# EAGLE design hotwave_V6 (EAGLE 8.5.2)
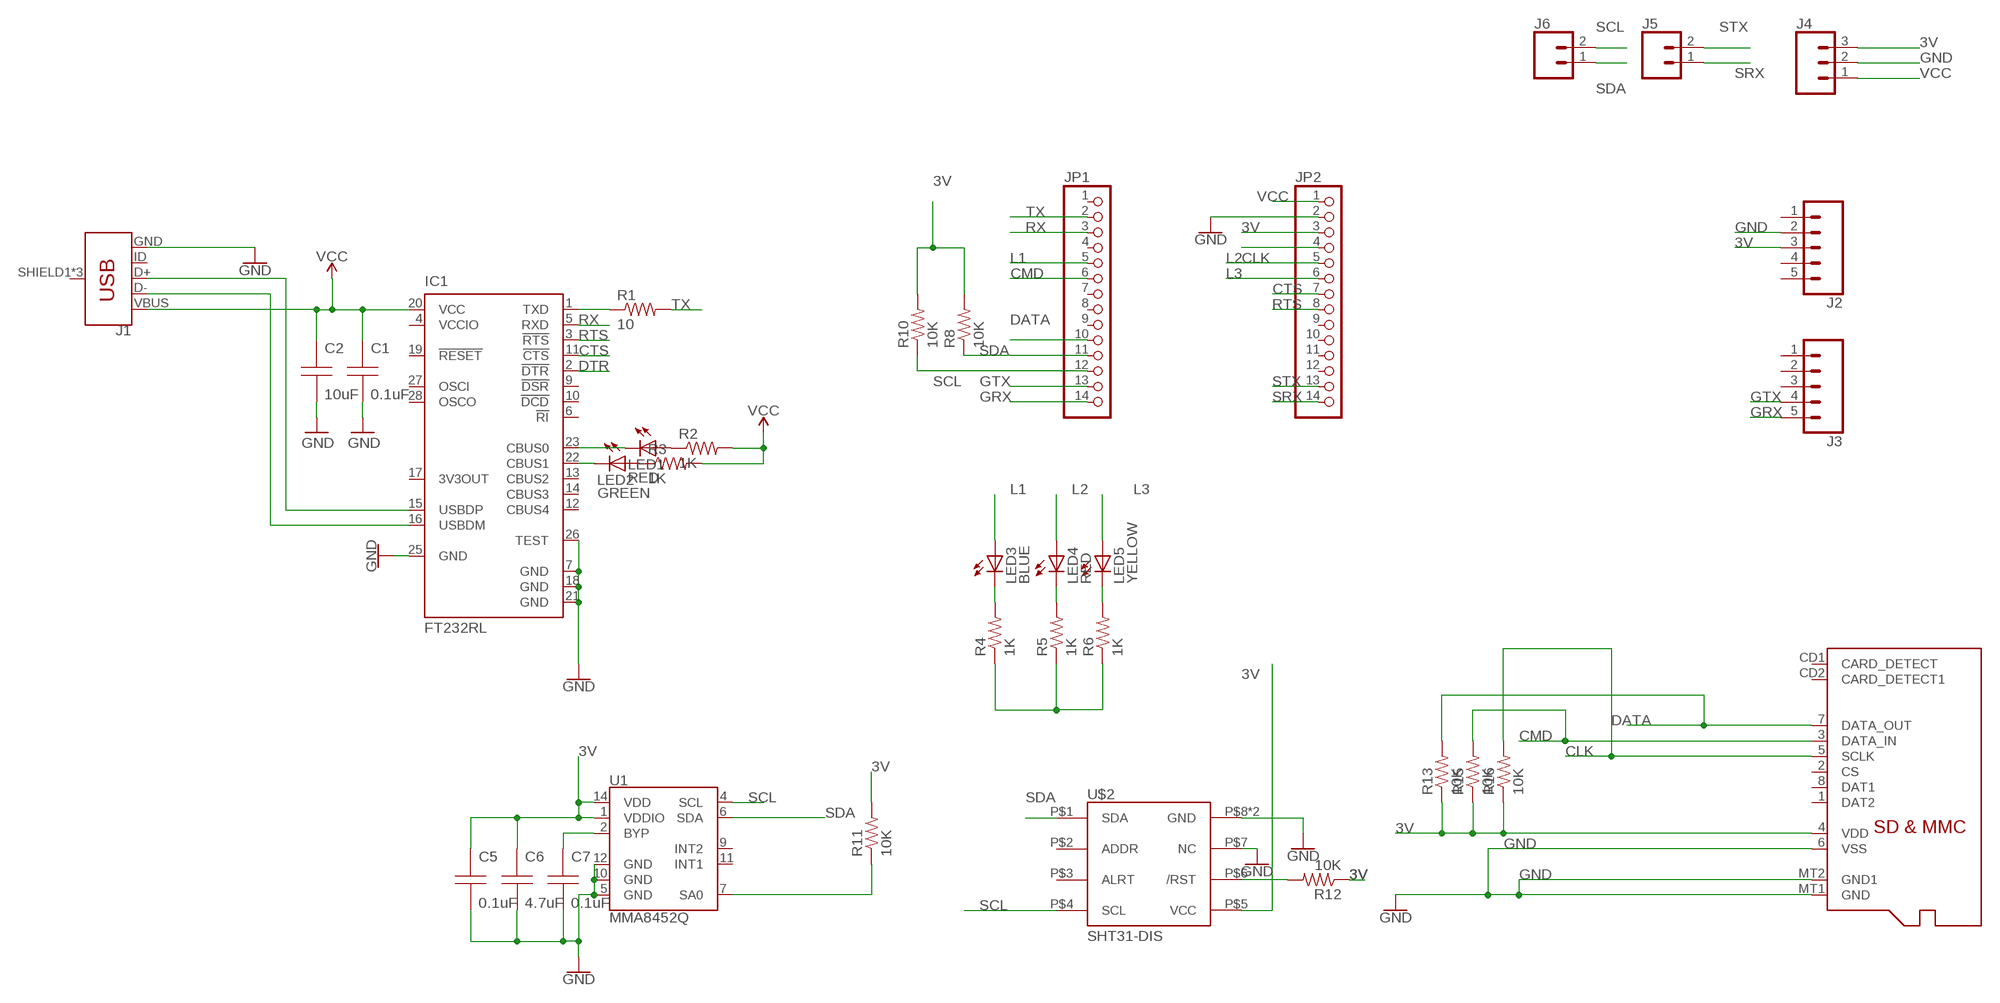
[diagram p0: schematic, sheet 1]

## Parts
C1  0.1uF  CAP  [C0805]
C2  10uF  CAP  [C0805]
C5  0.1uF  CAP  [C0805]
C6  4.7uF  CAP  [C0805]
C7  0.1uF  CAP  [C0805]
IC1  FT232RL  [SSOP28]
J1  USB_MICRO-B_FEMALE-SMT  [USB-B-MICRO-SMD]
J2  CONN_05  [1X05]
J3  CONN_05  [1X05]
J4  CONN_03  [1X03]
J5  CONN_02  [1X02]
J6  CONN_02  [1X02]
JP1  PINHD-1X14-CB  [1X14-CB]
JP2  PINHD-1X14-CB  [1X14-CB]
LED1  RED  LEDSML0805  [SML0805]
LED2  GREEN  LEDSML0805  [SML0805]
LED3  BLUE  LEDSML0805  [SML0805]
LED4  RED  LEDSML0805  [SML0805]
LED5  YELLOW  LEDSML0805  [SML0805]
R1  10  R-US_R0805  [R0805]
R2  1K  R-US_R0805  [R0805]
R3  1K  R-US_R0805  [R0805]
R4  1K  R-US_R0805  [R0805]
R5  1K  R-US_R0805  [R0805]
R6  1K  R-US_R0805  [R0805]
R8  10K  R-US_R0805  [R0805]
R10  10K  R-US_R0805  [R0805]
R11  10K  R-US_R0805  [R0805]
R12  10K  R-US_R0805  [R0805]
R13  10K  R-US_R0805  [R0805]
R15  10K  R-US_R0805  [R0805]
R16  10K  R-US_R0805  [R0805]
U1  MMA8452Q  [QFN-16]
U$1  MICROSD  [MICROSD]
U$2  SHT31-DIS  [SHT3X]

## Nets
3V: C5.1(A) C6.1(A) J2.3 J4.3 JP2.3 R8.2 R10.2 R11.2 R12.1 R13.1 R15.1 R16.1 U1.1(VDDIO) U1.14(VDD) U$1.4(VDD) U$2.P$5(VCC)
CLK: JP2.4 R16.2 U$1.5(SCLK)
CMD: JP1.6 R15.2 U$1.3(DATA_IN)
CTS: IC1.11(!CTS) JP2.7
DATA: JP1.10 R13.2 U$1.7(DATA_OUT)
DTR: IC1.2(!DTR)
GND: C1.2(B) C2.2(B) C5.2(B) C6.2(B) C7.2(B) IC1.7(GND) IC1.18(GND) IC1.21(GND) IC1.25(GND) IC1.26(TEST) J1.GND J2.2 J4.2 JP2.2 R4.1 R5.1 R6.1 U1.5(GND) U1.10(GND) U1.12(GND) U$1.6(VSS) U$1.MT1(GND) U$1.MT2(GND1) U$2.P$7(NC) U$2.P$8(GND) U$2.PAD(GND)
GRX: J3.5 JP1.14
GTX: J3.4 JP1.13
L1: JP1.5 LED3.A
L2: JP2.5 LED4.A
L3: JP2.6 LED5.A
N$1: IC1.15(USBDP) J1.D+
N$2: IC1.16(USBDM) J1.D-
N$3: IC1.1(TXD) R1.1
N$4: LED1.A R2.1
N$5: LED2.A R3.1
N$6: IC1.23(CBUS0) LED1.C
N$7: IC1.22(CBUS1) LED2.C
N$10: R11.1 U1.7(SA0)
N$14: C7.1(A) U1.2(BYP)
N$15: LED3.C R4.2
N$16: R12.2 U$2.P$6(/RST)
N$18: LED4.C R5.2
N$19: LED5.C R6.2
RTS: IC1.3(!RTS) JP2.8
RX: IC1.5(RXD) JP1.3
SCL: J6.2 JP1.12 R10.1 U1.4(SCL) U$2.P$4(SCL)
SDA: J6.1 JP1.11 R8.1 U1.6(SDA) U$2.P$1(SDA)
SRX: J5.1 JP2.14
STX: J5.2 JP2.13
TX: JP1.2 R1.2
VCC: C1.1(A) C2.1(A) IC1.20(VCC) J1.VBUS J4.1 JP2.1 R2.2 R3.2
Unconnected: IC1.6(!RI) IC1.9(!DSR) IC1.10(!DCD) IC1.12(CBUS4) IC1.13(CBUS2) IC1.14(CBUS3) IC1.17(3V3OUT) IC1.19(!RESET) IC1.27(OSCI) IC1.28(OSCO) J1.ID J1.SHIELD1(SHIELD) J1.SHIELD2(SHIELD) J1.SHIELD3(SHIELD) J2.1 J2.4 J2.5 J3.1 J3.2 J3.3 JP1.1 JP1.4 JP1.7 JP1.8 JP1.9 JP2.9 JP2.10 JP2.11 JP2.12 U1.9(INT2) U1.11(INT1) U$1.1(DAT2) U$1.2(CS) U$1.8(DAT1) U$1.CD1(CARD_DETECT) U$1.CD2(CARD_DETECT1) U$2.P$2(ADDR) U$2.P$3(ALRT)

## Power pins joined to a net without a drawn wire
VCCIO: IC1.4(VCCIO)

## Library data of the parts
C1 C2 C5-C7 = sym:CAP: Capacitor
IC1 = ftdichip:FT232R: Source: http://www.ftdichip.com/Documents/DataSheets/DS_FT232R_v104.pdf; MPN: FT232RL; OC_FARNELL: 1146032; OC_NEWARK: 91K9918
J1 = SparkFun-Connectors:USB_MICRO-B: USB Type Micro-B Connector Male/female and PTH/SMT variants SparkFun Products: SparkFun microB USB Breakout <https://www.sparkfun.com/products/12035> SparkFun USB microB Plug Breakout <https://www.sparkfun.com/products/10031> SparkFun ESP8266 Thing <https://www.sparkfun.com/products/13231>; PROD_ID: CONN-11752
J2 J3 = SparkFun-Connectors:CONN_05: Multi connection point. Often used as Generic Header-pin footprint for 0.1 inch spaced/style header connections On any of the 0.1 inch spaced packages, you can populate with these: Break Away Headers - Straight <https://www.sparkfun.com/products/116> (PRT-00116) Break Away Male Headers - Right Angle <https://www.sparkfun.com/products/553> (PRT-00553) Female Headers <https://www.sparkfun.com/products/115> (PRT-00115) Break Away Headers - Machine Pin <https://www.sparkfun.com/products/117> (PRT-00117) Break Away Female Headers - Swiss Machine Pin <https://www.sparkfun.com/products/743> (PRT-00743) For SCREWTERMINALS and SPRING TERMINALS visit here: Screw Terimnals on SparkFun.com <https://www.sparkfun.com/search/results?term=Screw+Terminals> (5mm/3.5mm/2.54mm spacing) This device is also useful as a general connection point to wire up your design to another part of your project. Our various solder wires solder well into these plated through hole pads. Hook-Up Wire - Assortment (Stranded, 22 AWG) <https://www.sparkfun.com/products/11375> (PRT-11375) Hook-Up Wire - Assortment (Solid Core, 22 AWG) <https://www.sparkfun.com/products/11367> (PRT-11367) View the entire wire category on our website here <https://www.sparkfun.com/categories/141> Special notes: Molex polarized connector foot print use with SKU : PRT-08231 with associated crimp pins and housings. 1MM SMD Version SKU: PRT-10208
J4 = SparkFun-Connectors:CONN_03: Multi connection point. Often used as Generic Header-pin footprint for 0.1 inch spaced/style header connections On any of the 0.1 inch spaced packages, you can populate with these: Break Away Headers - Straight <https://www.sparkfun.com/products/116> (PRT-00116) Break Away Male Headers - Right Angle <https://www.sparkfun.com/products/553> (PRT-00553) Female Headers <https://www.sparkfun.com/products/115> (PRT-00115) Break Away Headers - Machine Pin <https://www.sparkfun.com/products/117> (PRT-00117) Break Away Female Headers - Swiss Machine Pin <https://www.sparkfun.com/products/743> (PRT-00743) Stackable Header - 3 Pin (Female, 0.1") <https://www.sparkfun.com/products/13875> (PRT-13875) For SCREWTERMINALS and SPRING TERMINALS visit here: Screw Terimnals on SparkFun.com <https://www.sparkfun.com/search/results?term=Screw+Terminals> (5mm/3.5mm/2.54mm spacing) This device is also useful as a general connection point to wire up your design to another part of your project. Our various solder wires solder well into these plated through hole pads. Hook-Up Wire - Assortment (Stranded, 22 AWG) <https://www.sparkfun.com/products/11375> (PRT-11375) Hook-Up Wire - Assortment (Solid Core, 22 AWG) <https://www.sparkfun.com/products/11367> (PRT-11367) View the entire wire category on our website here <https://www.sparkfun.com/categories/141> Special notes: Molex polarized connector foot print use with SKU : PRT-08232 with associated crimp pins and housings.
J5 J6 = SparkFun-Connectors:CONN_02: Multi connection point. Often used as Generic Header-pin footprint for 0.1 inch spaced/style header connections On any of the 0.1 inch spaced packages, you can populate with these: Break Away Headers - Straight <https://www.sparkfun.com/products/116> (PRT-00116) Break Away Male Headers - Right Angle <https://www.sparkfun.com/products/553> (PRT-00553) Female Headers <https://www.sparkfun.com/products/115> (PRT-00115) Break Away Headers - Machine Pin <https://www.sparkfun.com/products/117> (PRT-00117) Break Away Female Headers - Swiss Machine Pin <https://www.sparkfun.com/products/743> (PRT-00743) For SCREWTERMINALS and SPRING TERMINALS visit here: Screw Terimnals on SparkFun.com <https://www.sparkfun.com/search/results?term=Screw+Terminals> (5mm/3.5mm/2.54mm spacing) This device is also useful as a general connection point to wire up your design to another part of your project. Our various solder wires solder well into these plated through hole pads. Hook-Up Wire - Assortment (Stranded, 22 AWG) <https://www.sparkfun.com/products/11375> (PRT-11375) Hook-Up Wire - Assortment (Solid Core, 22 AWG) <https://www.sparkfun.com/products/11367> (PRT-11367) View the entire wire category on our website here <https://www.sparkfun.com/categories/141> Special notes: Molex polarized connector foot print use with: PRT-08233 with associated crimp pins and housings. 2.54_SCREWTERM for use with PRT-10571. 3.5mm Screw Terminal footprints for PRT-08084 5mm Screw Terminal footprints for use with PRT-08432
JP1 JP2 = adafruit:PINHD-1X14: PIN HEADER
LED1-LED5 = led:LED: LED OSRAM: - CHIPLED LG R971, LG N971, LY N971, LG Q971, LY Q971, LO R971, LY R971 LH N974, LH R974 LS Q976, LO Q976, LY Q976 LO Q996 - Hyper CHIPLED LW Q18S LB Q993, LB Q99A, LB R99A - SideLED LS A670, LO A670, LY A670, LG A670, LP A670 LB A673, LV A673, LT A673, LW A673 LH A674 LY A675 LS A676, LA A676, LO A676, LY A676, LW A676 LS A679, LY A679, LG A679 - Hyper Micro SIDELED® LS Y876, LA Y876, LO Y876, LY Y876 LT Y87S - SmartLED LW L88C, LW L88S LB L89C, LB L89S, LG L890 LS L89K, LO L89K, LY L89K LS L896, LA L896, LO L896, LY L896 - TOPLED LS T670, LO T670, LY T670, LG T670, LP T670 LSG T670, LSP T670, LSY T670, LOP T670, LYG T670 LG T671, LOG T671, LSG T671 LB T673, LV T673, LT T673, LW T673 LH T674 LS T676, LA T676, LO T676, LY T676, LB T676, LH T676, LSB T676, LW T676 LB T67C, LV T67C, LT T67C, LS T67K, LO T67K, LY T67K, LW E67C LS E67B, LA E67B, LO E67B, LY E67B, LB E67C, LV E67C, LT E67C LW T67C LS T679, LY T679, LG T679 LS T770, LO T770, LY T770, LG T770, LP T770 LB T773, LV T773, LT T773, LW T773 LH T774 LS E675, LA E675, LY E675, LS T675 LS T776, LA T776, LO T776, LY T776, LB T776 LHGB T686 LT T68C, LB T68C - Hyper Mini TOPLED® LB M676 - Mini TOPLED Santana® LG M470 LS M47K, LO M47K, LY M47K Source: http://www.osram.convergy.de LUXEON: - LUMILED® LXK2-PW12-R00, LXK2-PW12-S00, LXK2-PW14-U00, LXK2-PW14-V00 LXK2-PM12-R00, LXK2-PM12-S00, LXK2-PM14-U00 LXK2-PE12-Q00, LXK2-PE12-R00, LXK2-PE12-S00, LXK2-PE14-T00, LXK2-PE14-U00 LXK2-PB12-K00, LXK2-PB12-L00, LXK2-PB12-M00, LXK2-PB14-N00, LXK2-PB14-P00, LXK2-PB14-Q00 LXK2-PR12-L00, LXK2-PR12-M00, LXK2-PR14-Q00, LXK2-PR14-R00 LXK2-PD12-Q00, LXK2-PD12-R00, LXK2-PD12-S00 LXK2-PH12-R00, LXK2-PH12-S00 LXK2-PL12-P00, LXK2-PL12-Q00, LXK2-PL12-R00 Source: www.luxeon.com KINGBRIGHT: KA-3528ASYC Source: www.kingbright.com
R1-R6 R8 R10-R13 R15 R16 = resistor:R-US_: RESISTOR, American symbol
U1 = SparkFun-Sensors:MMA8452Q: NXP MMA8452Q 3-Axis Digital Accelerometer The MMA8452Q is a smart low-power, three-axis, capacitive MEMS accelerometer with 12 bits of resolution. This accelerometer is packed with embedded functions with flexible user programmable options, configurable to two interrupt pins. Supply Voltage: 1.6-3.6V Range: +/- 2g, 4g, 8g Interface: I2C, 12-bit and 8-bit ODR: 1.56 Hz - 800 Hz Package: QFN-16 Datasheet <http://cache.freescale.com/files/sensors/doc/data_sheet/MMA8452Q.pdf> SparkFun Products SparkFun Triple Axis Accelerometer Breakout - MMA8452Q <https://www.sparkfun.com/products/12756> (SEN-12756) SparkFun RedBot Sensor - Accelerometer <https://www.sparkfun.com/products/12589> (SEN-12589); PROD_ID: IC-10769
U$1 = adafruit:MICROSD: Micro-SD / Transflash card holder with SPI pinout For the 3M # 2908-05WB-MG and/or 4UCON #19656 push-push type
U$2 = thomasb9511:SHT31-DIS

## Net classes
0 default: width 0.305 mm, drill 0.508 mm, clearance 0.254 mm

## Board
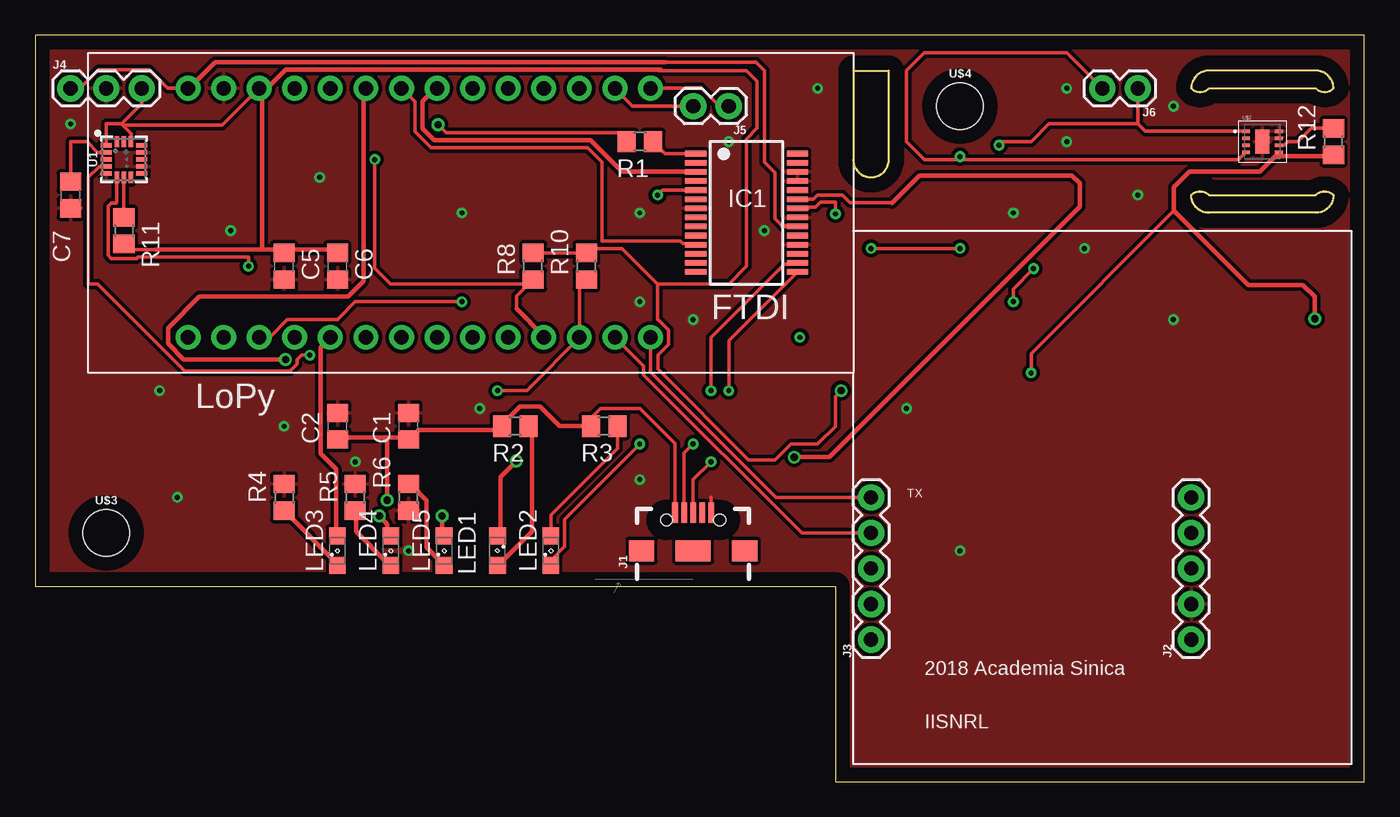
[diagram p1: board, top side]
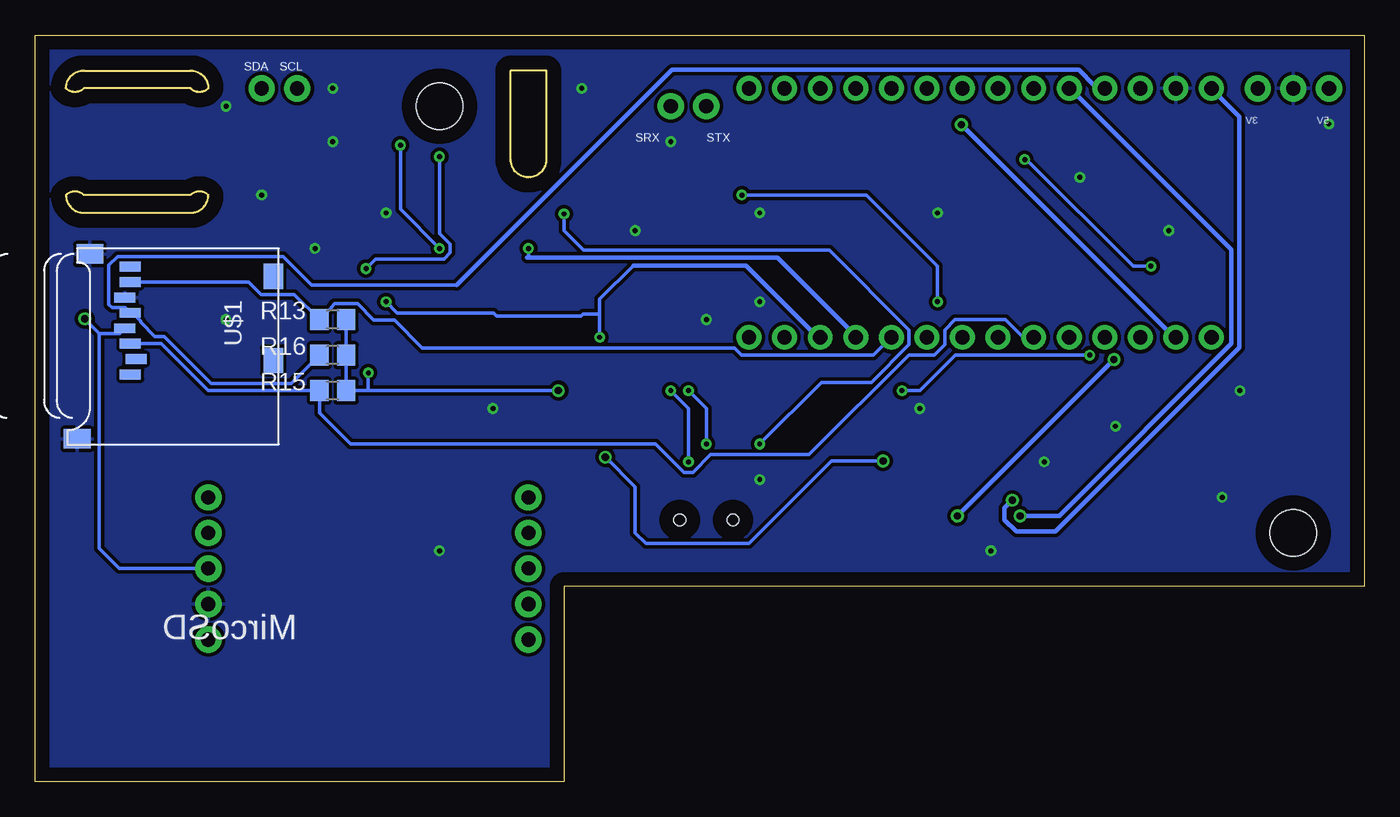
[diagram p2: board, bottom side, seen from below]

Size 94.92 x 53.34 mm. Coordinates in mm from the lower left corner, seen from the top.
Outline: 0,13.97 57.15,13.97 57.15,0 94.92,0 94.92,53.33 93.98,53.34 0,53.34 0,13.97
Outline: 82.55,49.53 arc90 83.82,49.53 91.44,49.53 arc90 92.71,49.53 arc90 91.44,50.8 83.82,50.8 arc90 82.55,49.53
Outline: 83.82,41.91 91.44,41.91 arc-90 92.71,41.91 arc-90 91.44,40.64 83.82,40.64 arc-90 82.55,41.91 arc-90 83.82,41.91
Outline: 58.42,50.8 58.42,44.45 arc90 59.69,43.18 arc90 60.96,44.45 60.96,50.8 58.42,50.8
Copper layers (1*16): Top 0.035mm / dielectric 1.5mm / Bottom 0.035mm
Design rules "default": minimum track width 6mil, minimum drill 0.35mm, track to track 6mil, track to pad 6mil, pad to pad 6mil, via to via 6mil, smd to smd 6mil, copper to edge 40mil, drill to drill 6mil, minimum pad ring 10mil, minimum via ring 8mil, stop-mask expansion 4mil, vias tented up to drill 0mil, thermal gap 10mil

### Footprints (pad centres in the part's own frame; a part is rotated, then mirrored left to right if it is on the bottom)
C0805 = smd 1.3 x 1.5: 1 -0.95,0; 2 0.95,0
SSOP28 = smd 0.4 x 1.5: 1 -4.225,-3.625; 2 -3.575,-3.625; 3 -2.925,-3.625; 4 -2.275,-3.625; 5 -1.625,-3.625; 6 -0.975,-3.625; 7 -0.325,-3.625; 8 0.325,-3.625; 9 0.975,-3.625; 10 1.625,-3.625; 11 2.275,-3.625; 12 2.925,-3.625; 13 3.575,-3.625; 14 4.225,-3.625; 15 4.225,3.625; 16 3.575,3.625; 17 2.925,3.625; 18 2.275,3.625; 19 1.625,3.625; 20 0.975,3.625; 21 0.325,3.625; 22 -0.325,3.625; 23 -0.975,3.625; 24 -1.625,3.625; 25 -2.275,3.625; 26 -2.925,3.625; 27 -3.575,3.625; 28 -4.225,3.625
USB-B-MICRO-SMD = smd 1.45 x 0.4: D+ 2.725,0; D- 2.725,0.65; GND 2.725,-1.3; ID 2.725,-0.65; VBUS 2.725,1.3 | smd 1.5 x 1.8: SHIELD1 0,3.685; SHIELD2 0,-3.685 | smd 1.5 x 2.5: SHIELD3 0,0 | hole 0.85: 2.2,1.9; 2.2,-1.9
1X05 = drill 1.016 pad 1.88: 1 0,0; 2 2.54,0; 3 5.08,0; 4 7.62,0; 5 10.16,0
1X03 = drill 1.016 pad 1.88: 1 0,0; 2 2.54,0; 3 5.08,0
1X02 = drill 1.016 pad 1.88: 1 0,0; 2 2.54,0
1X14-CB = drill 1.016 pad 1.778: 1 -16.51,0; 2 -13.97,0; 3 -11.43,0; 4 -8.89,0; 5 -6.35,0; 6 -3.81,0; 7 -1.27,0; 8 1.27,0; 9 3.81,0; 10 6.35,0; 11 8.89,0; 12 11.43,0; 13 13.97,0; 14 16.51,0
SML0805 = smd 1.2 x 1.2: A 1.05,0; C -1.05,0
R0805 = smd 1.3 x 1.5: 1 -0.95,0; 2 0.95,0
QFN-16 = smd 0.8 x 0.3: 1 -1.275,1; 2 -1.275,0.5; 3 -1.275,0; 4 -1.275,-0.5; 5 -1.275,-1; 9 1.275,-1; 10 1.275,-0.5; 11 1.275,0; 12 1.275,0.5; 13 1.275,1 | smd 0.3 x 0.8: 6 -0.5,-1.275; 7 0,-1.275; 8 0.5,-1.275; 14 0.5,1.275; 15 0,1.275; 16 -0.5,1.275
MICROSD = smd 0.7 x 1.5: 1 9,-10.64; 2 7.9,-10.24; 3 6.8,-10.64; 4 5.7,-11.04; 5 4.6,-10.64; 6 3.5,-11.04; 7 2.4,-10.64; 8 1.3,-10.64 | smd 1.8 x 1.4: CD1 2,-0.44; CD2 8,-0.44 | smd 1.4 x 1.9: MT1 0.4,-13.54; MT2 13.6,-14.44
SHT3X = smd 0.55 x 0.25: P$1 -1.175,0.75; P$2 -1.175,0.25; P$3 -1.175,-0.25; P$4 -1.175,-0.75; P$5 1.175,-0.75; P$6 1.175,-0.25; P$7 1.175,0.25; P$8 1.175,0.75 | smd 1 x 1.7: PAD 0,0
STAND-OFF = hole 3.302: 0,0

### Placement (x,y rotation side)
C1  26.67,25.4 90 top
C2  21.59,25.4 90 top
C5  17.78,36.83 270 top
C6  21.59,36.83 270 top
C7  2.54,41.91 270 top
IC1  50.8,40.64 270 top
J1  46.99,16.51 90 top
J2  82.55,10.16 90 top
J3  59.69,10.16 90 top
J4  2.54,49.53 0 top
J5  49.53,48.26 180 top
J6  78.74,49.53 180 top
JP1  27.43,31.75 0 top
JP2  27.43,49.53 0 top
LED1  33.02,16.51 270 top
LED2  36.83,16.51 90 top
LED3  21.59,16.51 90 top
LED4  25.4,16.51 90 top
LED5  29.21,16.51 90 top
R1  43.18,45.72 180 top
R2  34.29,25.4 180 top
R3  40.64,25.4 180 top
R4  17.78,20.32 270 top
R5  22.86,20.32 270 top
R6  26.67,20.32 90 top
R8  35.56,36.83 90 top
R10  39.37,36.83 90 top
R11  6.35,39.37 270 top
R12  92.71,45.72 90 top
R13  73.66,33.02 180 bottom
R15  73.66,27.94 180 bottom
R16  73.66,30.48 180 bottom
U1  6.35,44.45 0 top
U$1  77.47,38.1 270 bottom
U$2  87.63,45.72 0 top
U$3  [STAND-OFF]  5.08,17.78 0 top
U$4  [STAND-OFF]  66.04,48.26 0 top

### Tracks (layer width: path | path; a pad name or v marks a point on that pad's centre or on a via)
3V  (via drill 0.35, 0.51)
  Top 0.152: U$2.P$5 88.81,44.8 88.9,44.7
  Top 0.254: 88.9,44.7 88.9,44.88 88.81,44.96 | R8.2 R10.2 39.69,38.1 41.91,38.1 44.45,35.56 | U1.1 5.08,46.98 5.08,46.99 6.17,46.99 | 6.17,46.99 6.26,46.9 | 6.26,46.9 6.88,46.28 6.88,45.8 6.85,45.76 U1.14 | 6.26,46.9 13.37,46.9 16.1,49.63 | 8.89,38 6.77,38 R11.2 | 44.45,35.56 44.45,33.02 44.47,33.02 45.21,32.28 45.21,31.22 44.47,30.48 44.47,29.49 50.95,23.01 52.84,23.01 53.96,24.13 55.88,24.13 57.15,25.4 57.15,27.53 v57.56,27.94 | 44.45,35.56 49.53,35.56 50.8,36.83 50.8,45.92 51.56,46.68 51.56,50.04 50.8,50.8 44.5,50.8 44.45,50.85 | 81.31,40.79 71.12,30.61 v71.12,29.21 | 6.17,46.99 7.62,48.44 J4.3
  Top 0.305: v91.36,33.07 91.36,34.65 90.53,35.48 86.61,35.48 81.31,40.79 81.31,42.47 82.42,43.59 87.45,43.59 88.57,44.7 88.9,44.7 92.48,44.7 R12.1 | C6.1 21.51,38 17.88,38 C5.1 17.6,38 16.2,38 | 8.66,38 8.89,38 16.2,38 | 16.2,38 16.2,49.45 JP2.3 16.1,49.63 16.2,49.73 16.76,49.73 17.88,50.85 44.45,50.85 44.7,50.85
  Bottom 0.254: v91.36,33.07 90.32,32.03 | U$1.4 88.88,32.03 90.32,32.03 | v57.56,27.94 71.12,27.94 | 71.12,27.94 R15.1 R16.1 R13.1 | 90.32,32.03 90.32,16.66 88.9,15.24 J2.3 | v71.12,29.21 71.12,27.94
CLK
  Bottom 0.254: R16.2 76.64,28.45 82.34,28.45 85.7,31.81 86.36,31.81 87.38,32.83 87.38,32.91 87.97,33.5 U$1.5 88.48,33.87 89.42,33.87 89.64,34.09 89.64,36.91 89.02,37.53 77.2,37.53 75.16,35.48 64.82,35.48
  Bottom 0.305: 64.82,35.48 49.45,50.85 20.4,50.85 19.28,49.73 18.72,49.73 JP2.4
CMD
  Bottom 0.254: U$1.3 85.91,31.3 82.55,27.94 R15.2 74.61,26.35 72.39,24.13 50.6,24.13 48.57,22.1 47.95,22.1 46.68,23.37 39.65,23.37 32.54,30.48 30.72,30.48 29.97,31.22 29.97,32.28 29.23,33.02 25.64,33.02 24.37,31.75 JP1.6
CTS
  Top 0.254: JP2.7 27.13,48.56 27.13,46.44 28.28,45.29 39.45,45.29 40.47,44.28 40.47,38.62 46.08,38.62 46.27,38.43 47.11,38.43 IC1.11
DATA
  Bottom 0.254: U$1.7 79.65,35.7 78.77,34.82 76.41,34.82 R13.2 73.74,33.89 73.74,33.93 73.52,34.15 71.9,34.15 70.73,32.98 69.26,32.98 67.27,30.99 44.98,30.99 44.47,30.48 35.05,30.48 JP1.10
GND  (via drill 0.35)
  Top 0.254: J1.GND 48.26,20.32
  other vias: 66.04,16.51 62.23,26.67 46.99,33.02 43.18,40.64 49.53,45.72 55.88,49.53 73.66,49.53 78.74,41.91 81.28,48.26 20.32,43.18 13.97,39.37 8.89,27.94 10.16,20.32 17.78,25.4 26.67,16.51 31.75,26.67 69.85,40.64 74.93,38.1 43.18,34.29 73.66,45.72 22.86,22.86 52.07,39.37 43.18,21.59 81.28,33.02 2.54,46.99 30.48,40.64
  pour Top: 0,53.34 0,13.97 57.15,13.97 57.15,0 95.25,0 95.25,53.34
  pour Bottom: 0,53.34 0,13.97 57.15,13.97 57.15,0 95.25,0 95.25,53.34
GRX
  Top 0.254: JP1.14 43.96,31.73 43.96,29.28 52.92,20.32 J3.5
GTX
  Top 0.254: JP1.13 43.45,29.7 43.45,29.07 54.74,17.78 J3.4
L1
  Top 0.305: LED3.A 21.51,17.6 21.51,22.35 20.4,23.47 20.4,31.01 20.95,31.57 JP1.5
L2  (via drill 0.51)
  Top 0.305: v24.59,19 25.15,18.44 25.15,17.6 LED4.A
  Bottom 0.305: v24.59,19 21.79,19 9.5,31.29 9.5,38 20.95,49.45 JP2.5
L3  (via drill 0.51)
  Top 0.305: v29.06,19 29.06,17.6 LED5.A | v17.88,30.18 10.62,30.18 9.5,31.29 9.5,32.41 11.73,34.65 22.35,34.65 23.47,35.76 23.47,49.45 JP2.6
  Bottom 0.305: v17.88,30.18 v29.06,19
N$1  (via drill 0.35)
  Top 0.254: J1.D+ 46.99,21.59 v48.26,22.86 | v49.53,27.94 49.53,31.52 IC1.15
  Bottom 0.254: v48.26,22.86 48.26,26.67 v49.53,27.94
N$2  (via drill 0.35)
  Top 0.254: J1.D- 46.34,23.48 v46.99,24.13 | IC1.16 54.36,37 53.52,37 48.26,31.74 v48.26,27.94
  Bottom 0.254: v46.99,24.13 46.99,26.67 v48.26,27.94
N$3
  Top 0.254: R1.1 44.98,44.87 IC1.1
N$4
  Top 0.305: LED1.A 33.25,15.65 35.48,17.88 35.48,25.15 R2.1
N$5
  Top 0.254: R3.1 41.59,23.81 36.83,19.05 LED2.A
  Top 0.305: 41.35,25.15 R3.1
N$6  (via drill 0.51)
  Top 0.254: IC1.23 55.59,41.62 55.88,41.91 57.64,41.91 58.17,41.38 61.16,41.38 61.19,41.35
  Top 0.305: v34.37,22.91 33.25,21.79 33.25,17.6 LED1.C | v54.2,23.19 56.72,23.19 74.6,41.07 74.6,42.75 74.04,43.31 63.14,43.31 61.19,41.35 | 54.48,41.63 IC1.23
  Bottom 0.254: v34.37,22.91 38.05,22.91 43.94,17.02 51.31,17.02 52.07,17.78 52.07,21.06 v54.2,23.19
  Bottom 0.305: v54.2,23.19 53.92,22.91
N$7  (via drill 0.35)
  Top 0.254: LED2.C 36.83,15.82 37.81,16.8 37.81,18.76 v43.18,24.13 | 57.15,40.64 v57.15,40.57 57.15,41.4 56.09,41.4 55.72,41.03 54.91,41.03 54.84,40.97 | 54.84,40.97 55.23,40.97 | 54.84,40.97 IC1.22
  Bottom 0.254: v57.15,40.57 57.15,39.37 55.75,37.97 38.21,37.97 32.51,32.28 32.51,31.22 35.21,28.52 38.79,28.52 v43.18,24.13
N$10
  Top 0.254: U1.7 R11.1
N$14
  Top 0.254: 4.79,44.95 U1.2 4.49,44.95 3.72,45.72 2.54,45.72 C7.1
N$15
  Top 0.305: LED3.C 21.51,15.65 17.88,19.28 R4.2
N$16
  Top 0.254: R12.2 91.12,46.67 90.17,45.72 89.46,45.72 89.21,45.47 U$2.P$6
N$18
  Top 0.305: LED4.C 25.15,15.65 22.91,17.88 22.91,19.28 R5.2
N$19
  Top 0.305: LED5.C 29.06,15.65 27.94,16.76 27.94,20.12 26.82,21.23 R6.2
RTS
  Top 0.305: IC1.3 46.94,43.59 41.91,43.59 39.67,45.82 28.5,45.82 27.66,46.66 27.66,48.62 28.5,49.45 JP2.8
RX  (via drill 0.35)
  Top 0.254: JP1.3 16.75,31.75 18.02,33.02 21.59,33.02 22.86,34.29 v30.48,34.29 | IC1.5 44.8,42.27 v44.45,41.91
  Bottom 0.254: v30.48,34.29 30.48,36.83 35.56,41.91 v44.45,41.91
SCL  (via drill 0.35)
  Top 0.152: U$2.P$4 86.09,44.6
  Top 0.254: JP1.12 38.86,35.37 R10.1 | U1.4 4.58,43.95 3.81,43.18 3.81,35.56 4.48,35.56 10.7,29.34 18.23,29.34 18.72,29.83 18.72,30.15 19.05,30.48 v19.61,30.48 | v33.02,27.94 35.11,27.94 38.96,31.79 | 66.04,44.45 v66.04,44.65 | v71.29,36.66 69.85,35.21 v69.85,34.29 | 66.04,44.45 85.94,44.45 86.09,44.6 U$2.P$4 | J6.2 73.66,52.07 63.5,52.07 62.23,50.8 62.23,45.72 63.5,44.45 66.04,44.45
  Top 0.305: 39.12,31.85 38.96,31.79 JP1.12
  Bottom 0.254: v19.61,30.48 29.21,30.48 31.75,27.94 v33.02,27.94 | 54.61,33.42 v54.61,31.75 | 54.61,33.42 54.61,34.47 52.2,36.88 | 71.12,36.83 v71.29,36.66 70.61,37.34 65.73,37.34 65.28,37.79 65.28,38.41 66.04,39.17 v66.04,44.65 | 54.61,33.42 55.79,33.42 55.94,33.27 61.97,33.27 62.19,33.49 69.05,33.49 v69.85,34.29
  Bottom 0.305: 52.2,36.88 44.15,36.88 39.12,31.85 JP1.12
SDA  (via drill 0.35)
  Top 0.254: 34.37,33.81 34.37,34.69 35.24,35.56 | 35.24,35.56 R8.1 | U1.6 5.85,41.41 5.79,41.35 5.44,41.35 5.22,41.13 5.22,37.61 5.44,37.39 7.26,37.39 7.33,37.47 15.24,37.47 v15.24,36.83 | v24.25,44.45 24.25,36.71 25.4,35.56 35.24,35.56 | U$2.P$1 79.26,46.47 78.74,46.99 | 78.74,46.99 72.39,46.99 71.12,45.72 69.08,45.72 v68.83,45.47 | v66.04,38.1 v59.69,38.1 | J6.1 78.74,46.99
  Top 0.305: 34.37,33.81 36.32,31.85 JP1.11
  Bottom 0.254: v15.24,36.83 16.51,36.83 24.13,44.45 v24.25,44.45 | v68.83,45.47 68.83,40.89 v66.04,38.1 | v59.69,38.1 59.69,37.53 59.78,37.44
  Bottom 0.305: 59.78,37.44 41.91,37.44 36.32,31.85 JP1.11
SRX
  Top 0.254: J5.1 48.86,48.26 47.54,49.58 46.44,49.58 46.39,49.53 JP2.14
STX
  Top 0.254: JP2.13 42.67,48.26 J5.2
TX  (via drill 0.51)
  Top 0.254: v28.78,46.94 29.36,46.35 41.59,46.35 R1.2
  Bottom 0.305: v28.78,46.94 13.69,31.85 JP1.2
VCC  (via drill 0.51)
  Top 0.254: J1.VBUS 45.69,24.16 43.18,26.67 40.36,26.67 39.11,25.43 | J4.1 3.21,49.53 4.53,50.85 8.17,50.85 9.49,49.53 JP2.1 | 53.37,39.67 52.83,40.21 52.83,43.49 52.07,44.25 52.07,50.8 51.46,51.41 44.45,51.41
  Top 0.305: 25.15,24.59 26.54,24.59 C1.1 26.82,24.59 27.38,25.15 33.25,25.15 R2.2 33.25,25.43 34.65,26.82 36.04,26.82 37.44,25.43 39.11,25.43 39.67,25.43 R3.2 | 25.15,24.59 21.79,24.59 C2.1 | 53.37,39.67 54.2,39.67 IC1.20 | 44.98,51.41 44.45,51.41 12.85,51.41 11.18,49.73 JP2.1 | v25.15,20.12 25.15,24.59
  Bottom 0.305: v25.15,20.12 25.7,19.56 25.7,18.72 24.87,17.88 22.07,17.88 8.94,31.01 8.94,47.5 10.9,49.45 JP2.1

### Text on the board
tPlace: LoPy
tNames: FTDI | TX | 2018 Academia Sinica | IISNRL
bNames: SCL | SDA | 5V | 3V | STX | SRX | MircoSD